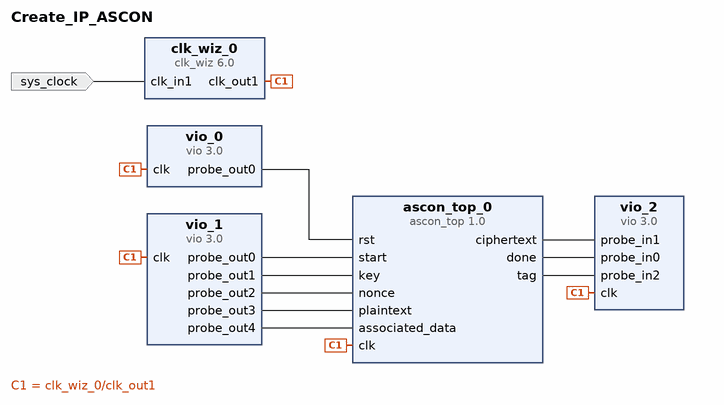
[diagram p0: block diagram of the top level]
# Vivado block design Create_IP_ASCON, xc7a35ticsg324-1L, Vivado 2022.1
create_bd_design Create_IP_ASCON

create_bd_port -dir I -type clk sys_clock
set_property -dict {CONFIG.FREQ_HZ 100000000 CONFIG.PHASE 0.0} [get_bd_ports sys_clock]

create_bd_cell -type ip -vlnv xilinx.com:ip:vio:3.0 vio_0
set_property -dict {CONFIG.C_NUM_PROBE_IN 0} [get_bd_cells vio_0]
create_bd_cell -type ip -vlnv xilinx.com:ip:vio:3.0 vio_1
set_property -dict [list \
  CONFIG.C_NUM_PROBE_IN 0 \
  CONFIG.C_NUM_PROBE_OUT 5 \
  CONFIG.C_PROBE_OUT1_INIT_VAL 0x0 \
  CONFIG.C_PROBE_OUT1_WIDTH 128 \
  CONFIG.C_PROBE_OUT2_WIDTH 128 \
  CONFIG.C_PROBE_OUT3_WIDTH 128 \
  CONFIG.C_PROBE_OUT4_WIDTH 128 \
] [get_bd_cells vio_1]
create_bd_cell -type ip -vlnv xilinx.com:ip:vio:3.0 vio_2
set_property -dict {CONFIG.C_EN_PROBE_IN_ACTIVITY 1 CONFIG.C_NUM_PROBE_IN 3 CONFIG.C_NUM_PROBE_OUT 0} [get_bd_cells vio_2]
create_bd_cell -type ip -vlnv xilinx.com:user:ascon_top:1.0 ascon_top_0
create_bd_cell -type ip -vlnv xilinx.com:ip:clk_wiz:6.0 clk_wiz_0
set_property -dict [list \
  CONFIG.CLKOUT2_JITTER 130.958 \
  CONFIG.CLKOUT2_PHASE_ERROR 98.575 \
  CONFIG.CLKOUT2_USED false \
  CONFIG.CLK_IN1_BOARD_INTERFACE sys_clock \
  CONFIG.CLK_IN2_BOARD_INTERFACE Custom \
  CONFIG.MMCM_CLKOUT1_DIVIDE 1 \
  CONFIG.NUM_OUT_CLKS 1 \
  CONFIG.RESET_BOARD_INTERFACE reset \
  CONFIG.RESET_PORT resetn \
  CONFIG.RESET_TYPE ACTIVE_LOW \
  CONFIG.USE_BOARD_FLOW true \
  CONFIG.USE_LOCKED false \
  CONFIG.USE_RESET false \
] [get_bd_cells clk_wiz_0]

# ---- connections ----

connect_bd_net [get_bd_pins ascon_top_0/ciphertext] [get_bd_pins vio_2/probe_in1]
connect_bd_net [get_bd_pins ascon_top_0/done] [get_bd_pins vio_2/probe_in0]
connect_bd_net [get_bd_pins ascon_top_0/tag] [get_bd_pins vio_2/probe_in2]
connect_bd_net [get_bd_pins clk_wiz_0/clk_out1] [get_bd_pins ascon_top_0/clk] [get_bd_pins vio_0/clk] [get_bd_pins vio_1/clk] [get_bd_pins vio_2/clk]
connect_bd_net [get_bd_ports sys_clock] [get_bd_pins clk_wiz_0/clk_in1]
connect_bd_net [get_bd_pins vio_0/probe_out0] [get_bd_pins ascon_top_0/rst]
connect_bd_net [get_bd_pins vio_1/probe_out0] [get_bd_pins ascon_top_0/start]
connect_bd_net [get_bd_pins vio_1/probe_out1] [get_bd_pins ascon_top_0/key]
connect_bd_net [get_bd_pins vio_1/probe_out2] [get_bd_pins ascon_top_0/nonce]
connect_bd_net [get_bd_pins vio_1/probe_out3] [get_bd_pins ascon_top_0/plaintext]
connect_bd_net [get_bd_pins vio_1/probe_out4] [get_bd_pins ascon_top_0/associated_data]

validate_bd_design
save_bd_design
